# EAGLE design H3BR61_Hardware (EAGLE 9.6.2)

## Sheet 1 of 2
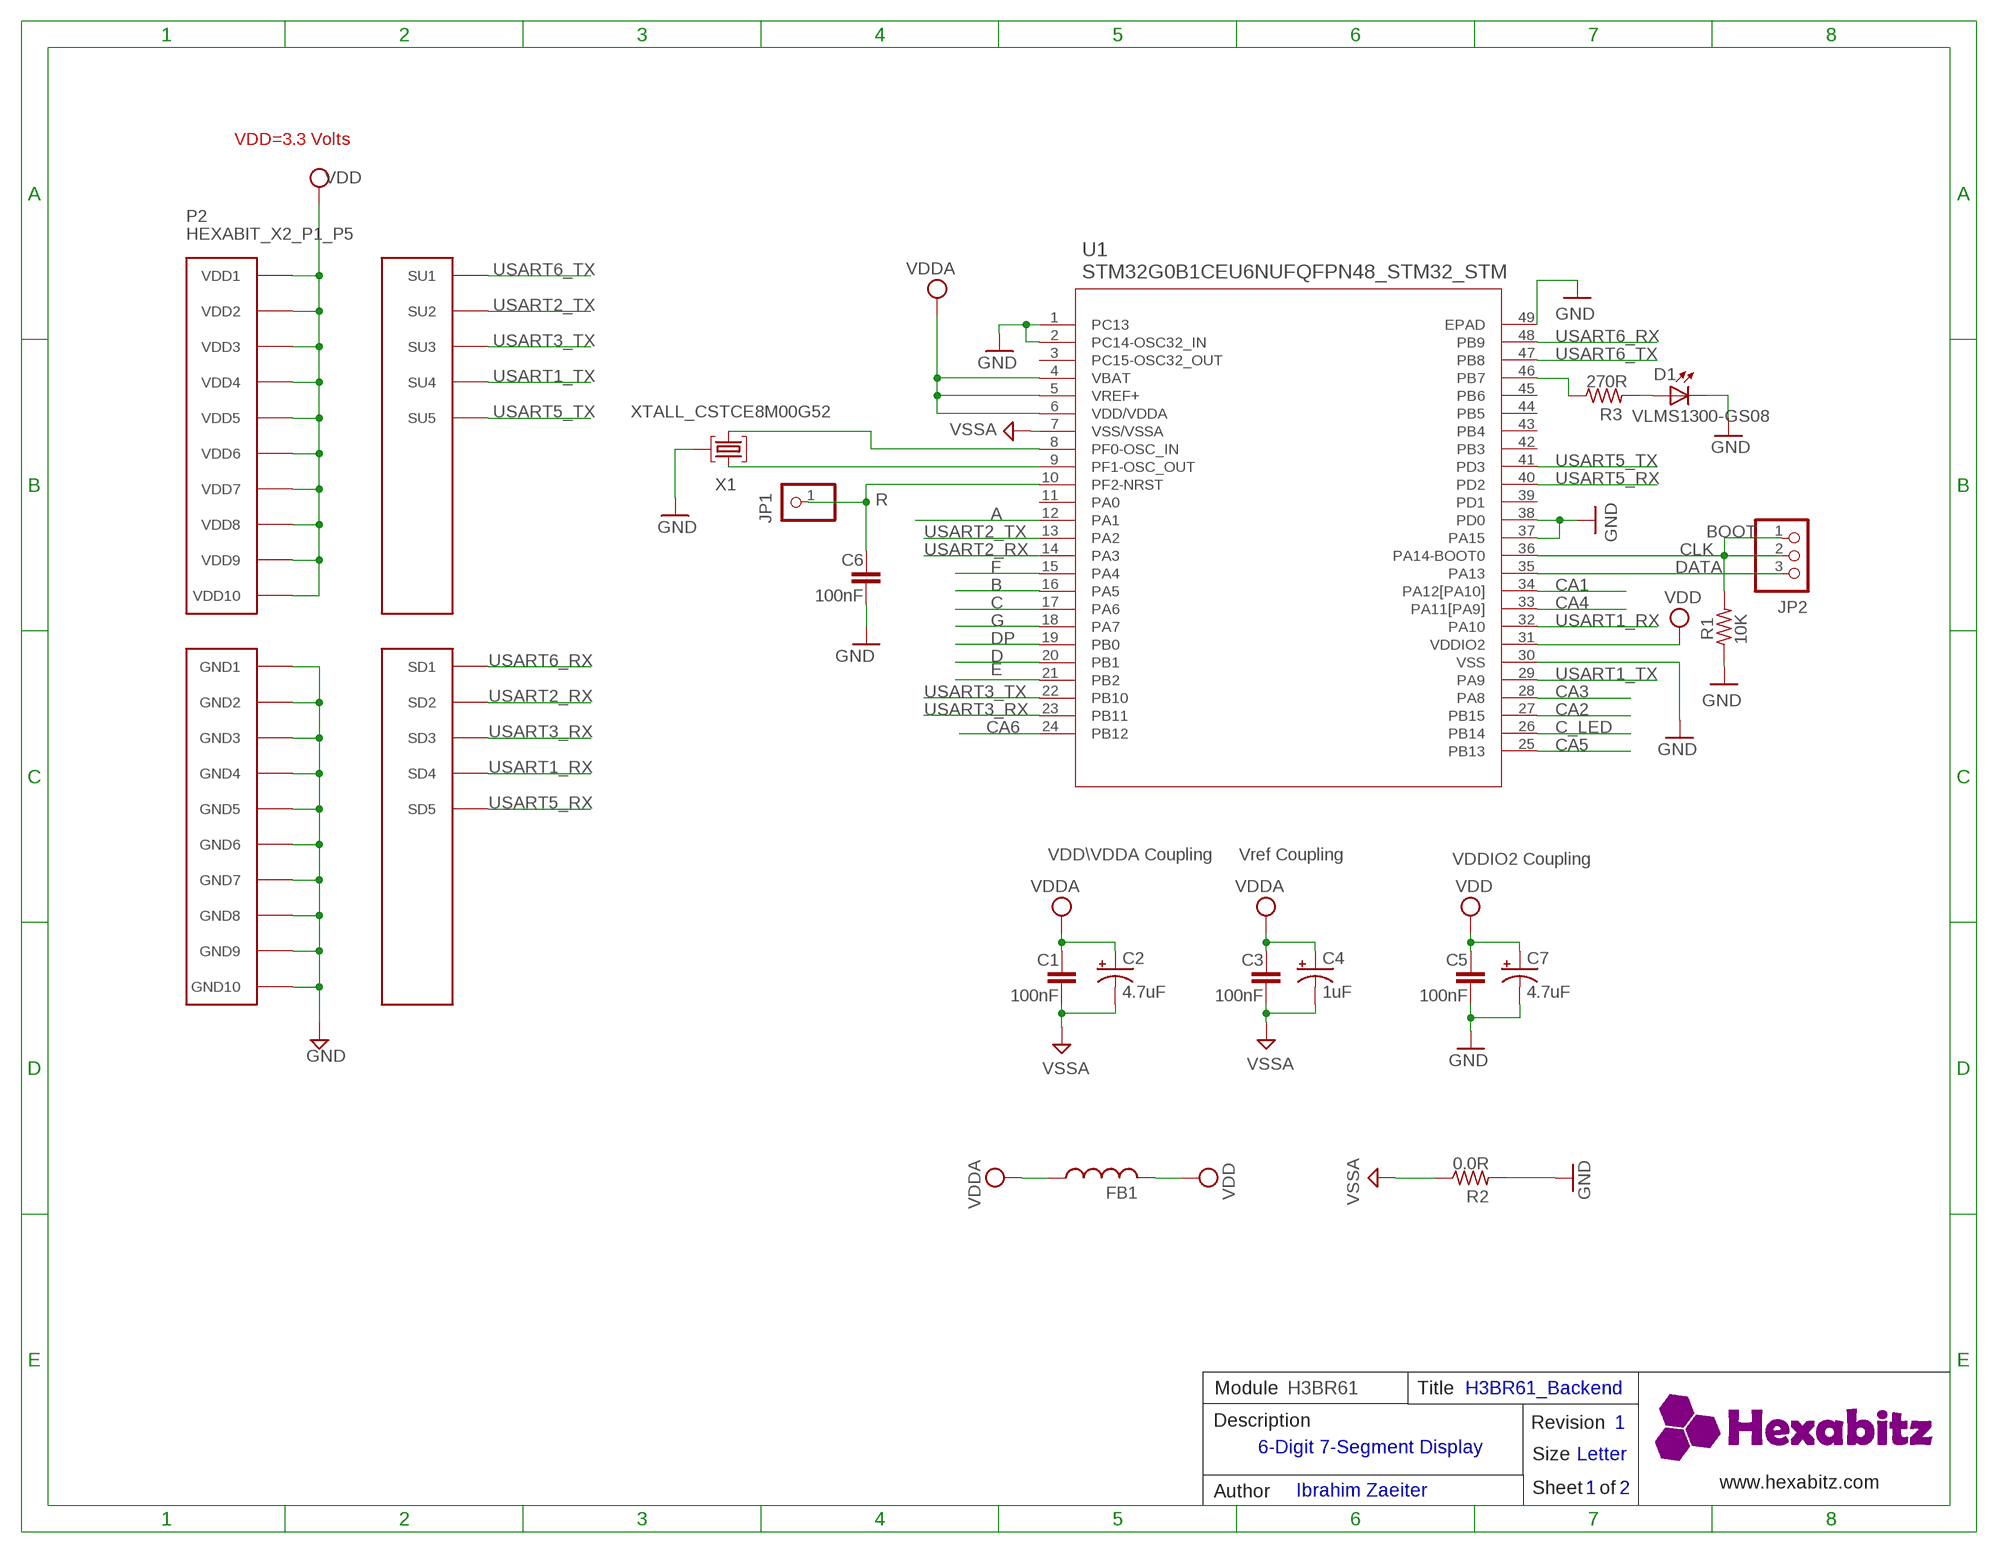
[diagram p0: schematic, sheet 1]

### Parts
C1  100nF  C-0603  [C-0603]
C2  4.7uF  C-0805-POL  [C-0805-POL]
C3  100nF  C-0603  [C-0603]
C4  1uF  C-0805-POL  [C-0805-POL]
C5  100nF  C-0603  [C-0603]
C6  100nF  C-0603  [C-0603]
C7  4.7uF  C-0805-POL  [C-0805-POL]
D1  VLMS1300-GS08  [VLMS1300-GS08]
FB1  FB-0603  [FB-0603]
JP1  R  PINHD-1X1  [1X01]
JP2  PINHD-1X3  [1X03]
P2  HEXABIT_X2_P1_P5  [HEXABIT_17.32_X2_P1_P5]
R1  10K  R-0603  [R-0603]
R2  0.0R  R-0603  [R-0603]
R3  270R  R-0603  [R-0603]
U1  STM32G0B1CEU6NUFQFPN48_STM32_STM  [UFQFPN48_STM32_STM]
X1  XTALL_CSTCE8M00G52  [XTALL_CSTCE8M00G52]

### Nets
A: U1.12(PA1) ; also sheet 2
B: U1.16(PA5) ; also sheet 2
C: U1.17(PA6) ; also sheet 2
C_LED: U1.26(PB14) ; also sheet 2
CA1: U1.34(PA12[PA10]) ; also sheet 2
CA2: U1.27(PB15) ; also sheet 2
CA3: U1.28(PA8) ; also sheet 2
CA4: U1.33(PA11[PA9]) ; also sheet 2
CA5: U1.25(PB13) ; also sheet 2
CA6: U1.24(PB12) ; also sheet 2
CLK: JP2.1 JP2.2 R1.2 U1.36(PA14-BOOT0)
D: U1.20(PB1) ; also sheet 2
DATA: JP2.3 U1.35(PA13)
DP: U1.19(PB0) ; also sheet 2
E: U1.21(PB2) ; also sheet 2
F: U1.15(PA4) ; also sheet 2
G: U1.18(PA7) ; also sheet 2
GND: C5.2 C6.2 C7.2(-) D1.C P2.PAD_PD11(GND1) P2.PAD_PD12(GND2) P2.PAD_PD13(GND3) P2.PAD_PD14(GND4) P2.PAD_PD15(GND5) P2.PAD_PD16(GND6) P2.PAD_PD17(GND7) P2.PAD_PD18(GND8) P2.PAD_PD19(GND9) P2.PAD_PD20(GND10) R1.1 R2.2 U1.1(PC13) U1.2(PC14-OSC32_IN) U1.30(VSS) U1.37(PA15) U1.38(PD0) U1.49(EPAD) X1.P$2 ; also sheet 2
N$1: D1.A R3.2
N$2: R3.1 U1.46(PB7)
N$5: U1.9(PF1-OSC_OUT) X1.P$1
N$6: U1.8(PF0-OSC_IN) X1.P$3
N$8: C6.1 JP1.1 U1.10(PF2-NRST)
USART1_RX: P2.PAD_PD4(SD4) U1.32(PA10)
USART1_TX: P2.PAD_PU4(SU4) U1.29(PA9)
USART2_RX: P2.PAD_PD2(SD2) U1.14(PA3)
USART2_TX: P2.PAD_PU2(SU2) U1.13(PA2)
USART3_RX: P2.PAD_PD3(SD3) U1.23(PB11)
USART3_TX: P2.PAD_PU3(SU3) U1.22(PB10)
USART5_RX: P2.PAD_PD5(SD5) U1.40(PD2)
USART5_TX: P2.PAD_PU5(SU5) U1.41(PD3)
USART6_RX: P2.PAD_PD1(SD1) U1.48(PB9)
USART6_TX: P2.PAD_PU1(SU1) U1.47(PB8)
VDD: C5.1 C7.1(+) FB1.2 P2.PAD_PU11(VDD1) P2.PAD_PU12(VDD2) P2.PAD_PU13(VDD3) P2.PAD_PU14(VDD4) P2.PAD_PU15(VDD5) P2.PAD_PU16(VDD6) P2.PAD_PU17(VDD7) P2.PAD_PU18(VDD8) P2.PAD_PU19(VDD9) P2.PAD_PU20(VDD10) U1.31(VDDIO2) ; also sheet 2
VDDA: C1.1 C2.1(+) C3.1 C4.1(+) FB1.1 U1.4(VBAT) U1.5(VREF+) U1.6(VDD/VDDA)
VSSA: C1.2 C2.2(-) C3.2 C4.2(-) R2.1 U1.7(VSS/VSSA)
Unconnected: U1.3(PC15-OSC32_OUT) U1.11(PA0) U1.39(PD1) U1.42(PB3) U1.43(PB4) U1.44(PB5) U1.45(PB6)

### Notes on the sheet
- VDD=3.3 Volts
- BOOT
- VDD\VDDA Coupling | Vref Coupling | VDDIO2 Coupling
- Module | H3BR61 | Title | H3BR61_Backend
- Description | Revision | 1
- 6-Digit 7-Segment Display
- Size | Letter
- www.hexabitz.com
- Author | Ibrahim Zaeiter | Sheet   of | 1 | 2
- C:/Users/Admin/Desktop/logodraft.bmp

## Sheet 2 of 2
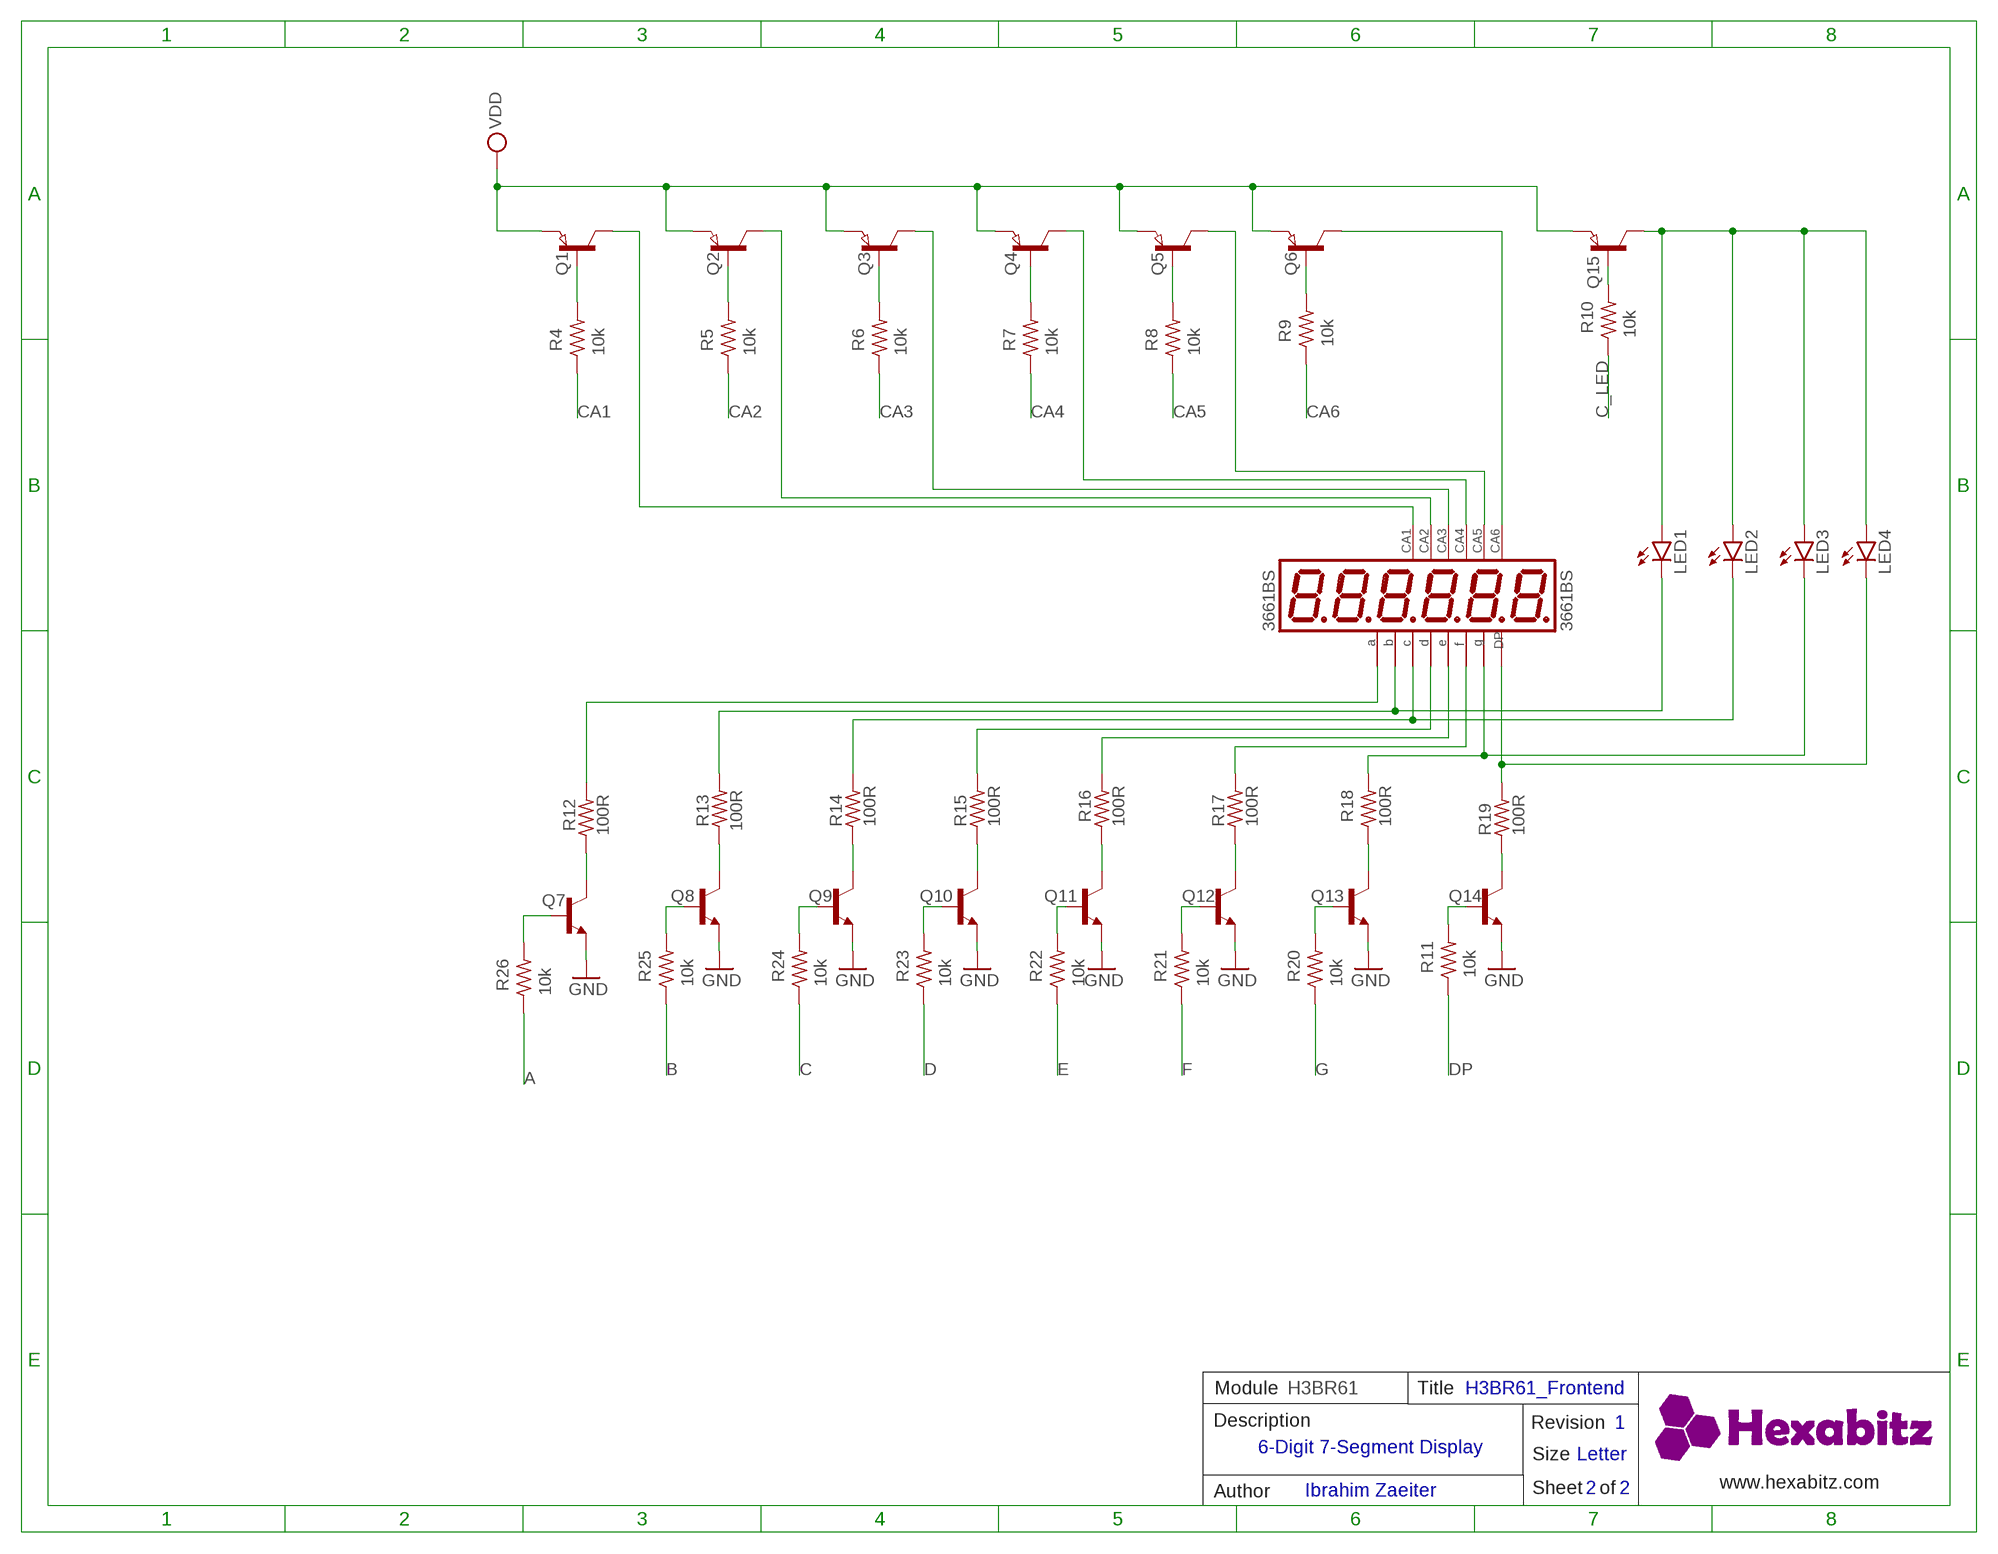
[diagram p1: schematic, sheet 2]

### Parts
3661BS  3661BS  [3661BS]
LED1  LED3MM  [LED3MM]
LED2  LED3MM  [LED3MM]
LED3  LED3MM  [LED3MM]
LED4  LED3MM  [LED3MM]
Q1  SEMICON-SMD-IPC_PNP-TRANSISTOR_SOT23  [SEMICON-SMD-IPC_SOT23]
Q2  SEMICON-SMD-IPC_PNP-TRANSISTOR_SOT23  [SEMICON-SMD-IPC_SOT23]
Q3  SEMICON-SMD-IPC_PNP-TRANSISTOR_SOT23  [SEMICON-SMD-IPC_SOT23]
Q4  SEMICON-SMD-IPC_PNP-TRANSISTOR_SOT23  [SEMICON-SMD-IPC_SOT23]
Q5  SEMICON-SMD-IPC_PNP-TRANSISTOR_SOT23  [SEMICON-SMD-IPC_SOT23]
Q6  SEMICON-SMD-IPC_PNP-TRANSISTOR_SOT23  [SEMICON-SMD-IPC_SOT23]
Q7  MMBT3904LT1  [MMBT3904LT1]
Q8  MMBT3904LT1  [MMBT3904LT1]
Q9  MMBT3904LT1  [MMBT3904LT1]
Q10  MMBT3904LT1  [MMBT3904LT1]
Q11  MMBT3904LT1  [MMBT3904LT1]
Q12  MMBT3904LT1  [MMBT3904LT1]
Q13  MMBT3904LT1  [MMBT3904LT1]
Q14  MMBT3904LT1  [MMBT3904LT1]
Q15  SEMICON-SMD-IPC_PNP-TRANSISTOR_SOT23  [SEMICON-SMD-IPC_SOT23]
R4  10k  R-0603  [R-0603]
R5  10k  R-0603  [R-0603]
R6  10k  R-0603  [R-0603]
R7  10k  R-0603  [R-0603]
R8  10k  R-0603  [R-0603]
R9  10k  R-0603  [R-0603]
R10  10k  R-0603  [R-0603]
R11  10k  R-0603  [R-0603]
R12  100R  R-0603  [R-0603]
R13  100R  R-0603  [R-0603]
R14  100R  R-0603  [R-0603]
R15  100R  R-0603  [R-0603]
R16  100R  R-0603  [R-0603]
R17  100R  R-0603  [R-0603]
R18  100R  R-0603  [R-0603]
R19  100R  R-0603  [R-0603]
R20  10k  R-0603  [R-0603]
R21  10k  R-0603  [R-0603]
R22  10k  R-0603  [R-0603]
R23  10k  R-0603  [R-0603]
R24  10k  R-0603  [R-0603]
R25  10k  R-0603  [R-0603]
R26  10k  R-0603  [R-0603]

### Nets
A: R26.1 ; also sheet 1
B: R25.1 ; also sheet 1
C: R24.1 ; also sheet 1
C_LED: R10.1 ; also sheet 1
CA1: R4.1 ; also sheet 1
CA2: R5.1 ; also sheet 1
CA3: R6.1 ; also sheet 1
CA4: R7.1 ; also sheet 1
CA5: R8.1 ; also sheet 1
CA6: R9.1 ; also sheet 1
D: R23.1 ; also sheet 1
DP: R11.1 ; also sheet 1
E: R22.1 ; also sheet 1
F: R21.1 ; also sheet 1
G: R20.1 ; also sheet 1
GND: Q7.2(E) Q8.2(E) Q9.2(E) Q10.2(E) Q11.2(E) Q12.2(E) Q13.2(E) Q14.2(E) ; also sheet 1
N$9: Q7.1(B) R26.2
N$10: Q8.1(B) R25.2
N$11: Q9.1(B) R24.2
N$12: Q10.1(B) R23.2
N$13: Q11.1(B) R22.2
N$14: Q12.1(B) R21.2
N$15: Q13.1(B) R20.2
N$16: Q14.1(B) R11.2
N$17: Q7.3(C) R12.1
N$18: Q8.3(C) R13.1
N$19: Q9.3(C) R14.1
N$20: Q10.3(C) R15.1
N$21: Q11.3(C) R16.1
N$22: Q12.3(C) R17.1
N$23: Q13.3(C) R18.1
N$24: Q14.3(C) R19.1
N$25: Q1.1(B) R4.2
N$26: Q2.1(B) R5.2
N$27: Q3.1(B) R6.2
N$28: Q4.1(B) R7.2
N$29: Q5.1(B) R8.2
N$30: Q6.1(B) R9.2
N$31: 3661BS.3(DP) LED4.K(C) R19.2
N$32: 3661BS.5(G) LED3.K(C) R18.2
N$33: 3661BS.12(F) R17.2
N$34: 3661BS.1(E) R16.2
N$35: 3661BS.2(D) R15.2
N$36: 3661BS.4(C) LED2.K(C) R14.2
N$37: 3661BS.9(B) LED1.K(C) R13.2
N$38: 3661BS.13(A) R12.2
N$39: 3661BS.7(CA) Q6.3(C)
N$40: 3661BS.6(CA) Q5.3(C)
N$41: 3661BS.8(CA) Q4.3(C)
N$42: 3661BS.10(CA) Q3.3(C)
N$43: 3661BS.11(CA) Q2.3(C)
N$44: 3661BS.14(CA) Q1.3(C)
N$45: Q15.1(B) R10.2
N$46: LED1.A LED2.A LED3.A LED4.A Q15.3(C)
VDD: Q1.2(E) Q2.2(E) Q3.2(E) Q4.2(E) Q5.2(E) Q6.2(E) Q15.2(E) ; also sheet 1

### Notes on the sheet
- Module | H3BR61 | Title | H3BR61_Frontend
- Description | Revision | 1
- 6-Digit 7-Segment Display
- Size | Letter
- www.hexabitz.com
- Author | Ibrahim Zaeiter | Sheet   of | 2 | 2
- C:/Users/Admin/Desktop/logodraft.bmp

## Library data of the parts
3661BS = HEXABITZ_OTHER_PARTS:3661BS: 0.36inch 6digits RED 8 segment led display 3661BS
C1 C3 C5 C6 = HEXABITZ_RCLS:C-0603: CAP CER 10% X7R 0603
C2 C4 C7 = HEXABITZ_RCLS:C-0805-POL: Cap Tant Solid SMD 2012
D1 = Hexabitz:VLMS1300-GS08: Red 0603 130° Clear 54 mcd 2 V Surface Mount ChipLED ; Octopart Url : http://octopart.com/vlms1300-gs08-vishay-21709201; MFN: Vishay; MPN: VLMS1300-GS08; OCTOPART_URL: https://octopart.com/vlms1300-gs08-vishay-21709201?r=sp&s=_gcP4_q8T1SC6PJQPTQ9yA
FB1 = HEXABITZ_RCLS:FB-0603: Ferrite Beads Multi-Layer 0603
JP1 = HEXABITZ_USER_INTERFACE_PARTS:PINHD-1X1: PIN HEADER; MFN: TE Connectivity; MPN: 87227-1; OCTOPART_URL: https://octopart.com/87227-1-te+connectivity-39512052?r=sp
JP2 = pinhead:PINHD-1X3: PIN HEADER
LED1-LED4 = led:LED: LED OSRAM: - CHIPLED LG R971, LG N971, LY N971, LG Q971, LY Q971, LO R971, LY R971 LH N974, LH R974 LS Q976, LO Q976, LY Q976 LO Q996 - Hyper CHIPLED LW Q18S LB Q993, LB Q99A, LB R99A - SideLED LS A670, LO A670, LY A670, LG A670, LP A670 LB A673, LV A673, LT A673, LW A673 LH A674 LY A675 LS A676, LA A676, LO A676, LY A676, LW A676 LS A679, LY A679, LG A679 - Hyper Micro SIDELED® LS Y876, LA Y876, LO Y876, LY Y876 LT Y87S - SmartLED LW L88C, LW L88S LB L89C, LB L89S, LG L890 LS L89K, LO L89K, LY L89K LS L896, LA L896, LO L896, LY L896 - TOPLED LS T670, LO T670, LY T670, LG T670, LP T670 LSG T670, LSP T670, LSY T670, LOP T670, LYG T670 LG T671, LOG T671, LSG T671 LB T673, LV T673, LT T673, LW T673 LH T674 LS T676, LA T676, LO T676, LY T676, LB T676, LH T676, LSB T676, LW T676 LB T67C, LV T67C, LT T67C, LS T67K, LO T67K, LY T67K, LW E67C LS E67B, LA E67B, LO E67B, LY E67B, LB E67C, LV E67C, LT E67C LW T67C LS T679, LY T679, LG T679 LS T770, LO T770, LY T770, LG T770, LP T770 LB T773, LV T773, LT T773, LW T773 LH T774 LS E675, LA E675, LY E675, LS T675 LS T776, LA T776, LO T776, LY T776, LB T776 LHGB T686 LT T68C, LB T68C - Hyper Mini TOPLED® LB M676 - Mini TOPLED Santana® LG M470 LS M47K, LO M47K, LY M47K Source: http://www.osram.convergy.de LUXEON: - LUMILED® LXK2-PW12-R00, LXK2-PW12-S00, LXK2-PW14-U00, LXK2-PW14-V00 LXK2-PM12-R00, LXK2-PM12-S00, LXK2-PM14-U00 LXK2-PE12-Q00, LXK2-PE12-R00, LXK2-PE12-S00, LXK2-PE14-T00, LXK2-PE14-U00 LXK2-PB12-K00, LXK2-PB12-L00, LXK2-PB12-M00, LXK2-PB14-N00, LXK2-PB14-P00, LXK2-PB14-Q00 LXK2-PR12-L00, LXK2-PR12-M00, LXK2-PR14-Q00, LXK2-PR14-R00 LXK2-PD12-Q00, LXK2-PD12-R00, LXK2-PD12-S00 LXK2-PH12-R00, LXK2-PH12-S00 LXK2-PL12-P00, LXK2-PL12-Q00, LXK2-PL12-R00 Source: www.luxeon.com KINGBRIGHT: KA-3528ASYC Source: www.kingbright.com
P2 = hexabitz_connectors:HEXABIT_X2_P1_P5
Q1-Q6 Q15 = HEXABITZ_RCLS:SEMICON-SMD-IPC_PNP-TRANSISTOR_: PNP TRANSISTOR
Q7-Q14 = HEXABITZ_RCLS:MMBT3904LT1: TRANS NPN 40V 0.2A SOT23; MOUNTING_STYLE: Surface Mount; NUM_OF_PINS: 3; PACKAGE: SOT-23-3; PACKAGING: Reel; PRODUCT_CATEGORY: Transistors Bipolar-BJT; SERIES: MMBT3904L
R1-R26 = HEXABITZ_RCLS:R-0603: Thick Film Resistors - SMD 0603
U1 = HEXABITZ_ICs:STM32G0B1CEU6N; COPYRIGHT: Copyright (C) 2022 Ultra Librarian. All rights reserved.; MFN: STMicroelectronics; MPN: STM32G0B1CEU6N; OCTOPART_URL: https://app.ultralibrarian.com/details/c038d58b-752a-11eb-9033-0a34d6323d74/STMicroelectronics/STM32G0B1CEU6N?uid=116364672
X1 = Hexabitz:XTALL_CSTCE8M00G52: MURATA CSTCE8M00G52-R0 RESONATOR, SMD, 8MHZ ; Octopart Url : https://octopart.com/cstce8m00g52-r0-murata-7145559; MFN: Murata; MPN: CSTCE8M00G52Z-R0; OCTOPART_URL: https://octopart.com/cstce8m00g52z-r0-murata-17755941?r=sp&s=JDnNJnrHQhyS8Zk4ofFWXw

## Board
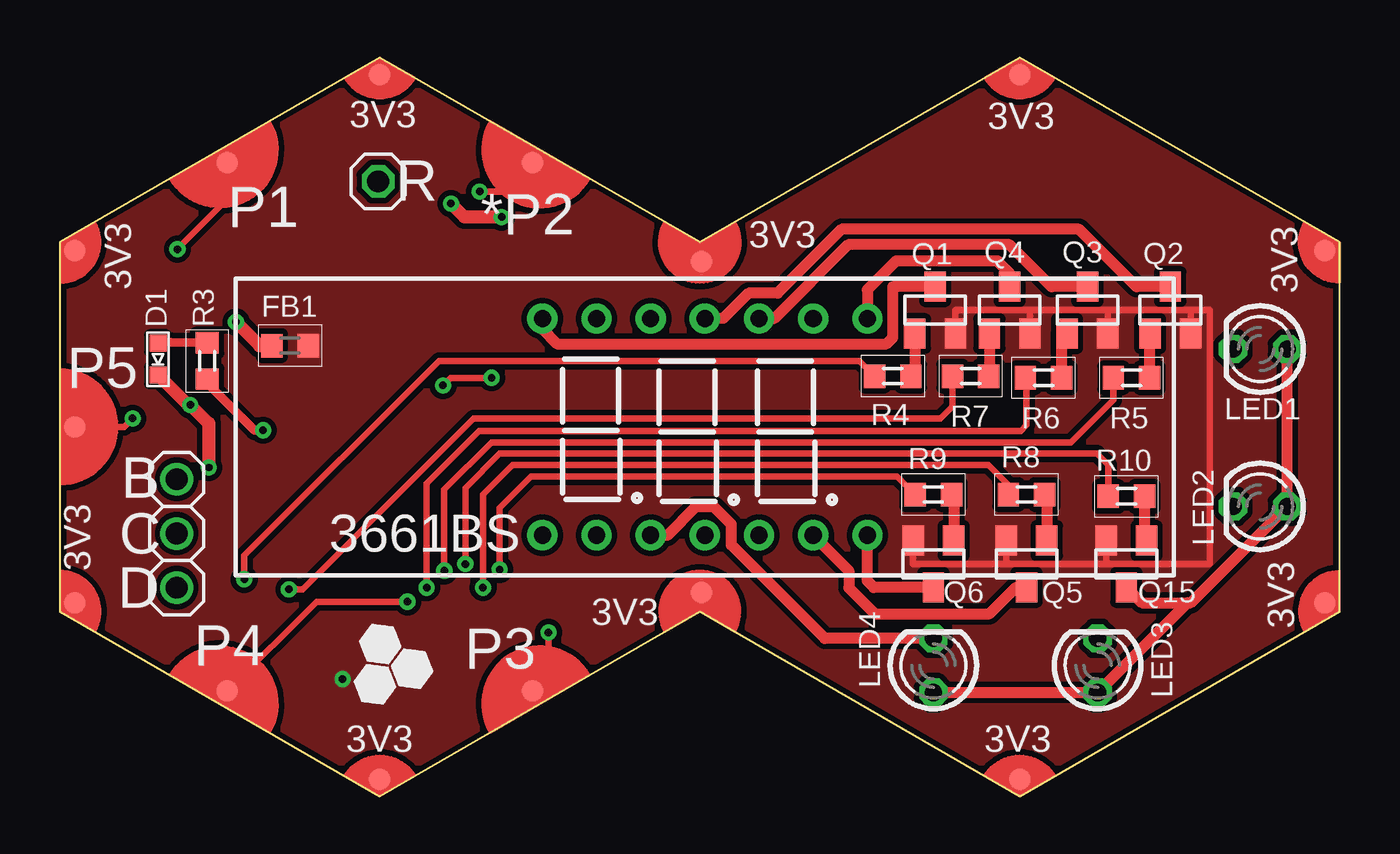
[diagram p2: board, top side]
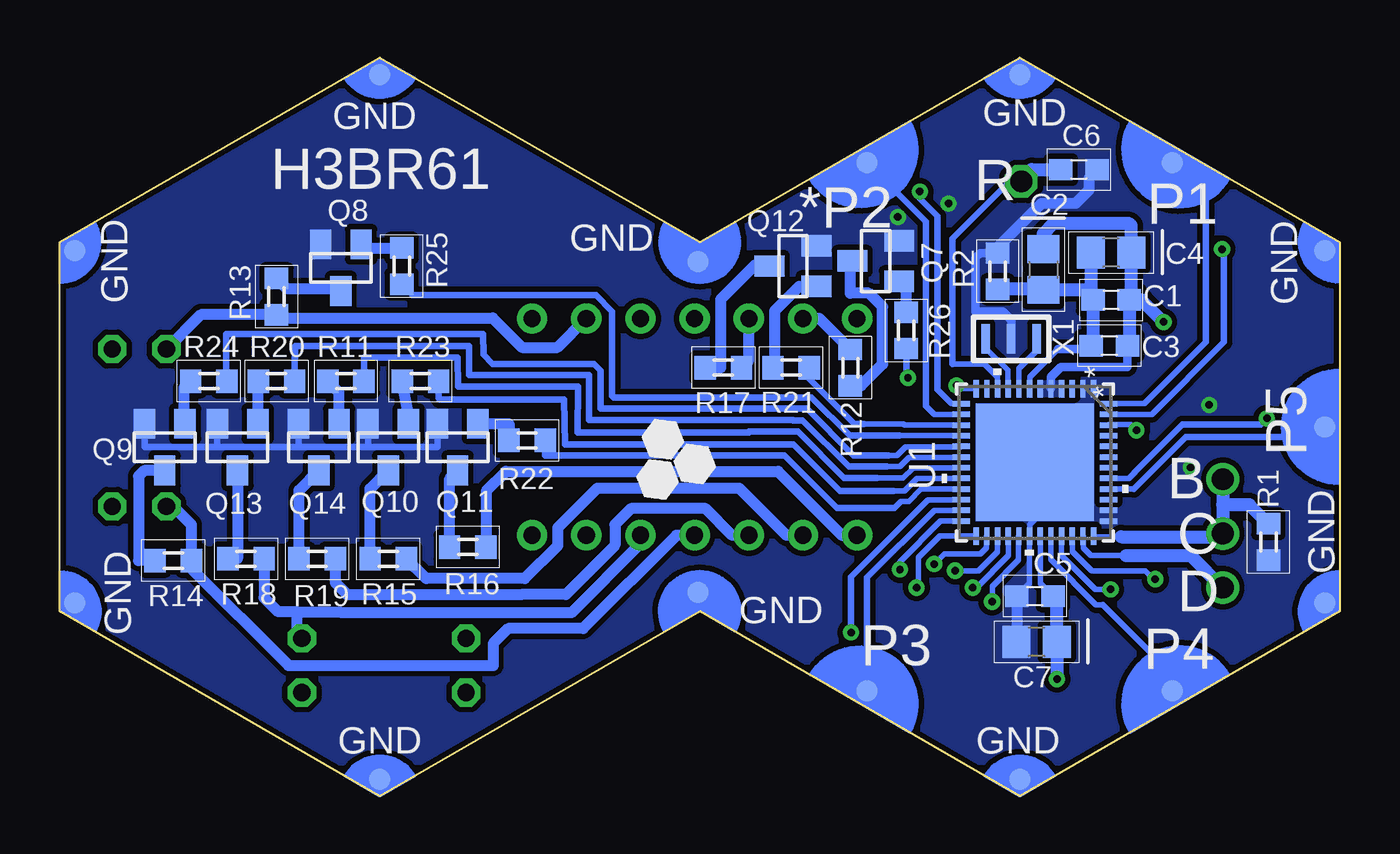
[diagram p3: board, bottom side, seen from below]

Size 60 x 34.64 mm. Coordinates in mm from the lower left corner, seen from the top.
Copper layers (1*16): Top 0.035mm / dielectric 1.5mm / Bottom 0.035mm
Design rules "default *": minimum track width 6mil, minimum drill 0.35mm, track to track 9mil, track to pad 9mil, pad to pad 9mil, via to via 9mil, smd to smd 9mil, copper to edge 10mil, drill to drill 6mil, minimum pad ring 10mil, minimum via ring 8mil, stop-mask expansion 4mil, vias tented up to drill 24mil, thermal gap 10mil

### Footprints (pad centres in the part's own frame; a part is rotated, then mirrored left to right if it is on the bottom)
3661BS = drill 0.8 pad 1.422: 1 -7.62,-5.08; 2 -5.08,-5.08; 3 -2.54,-5.08; 4 0,-5.08; 5 2.54,-5.08; 6 5.08,-5.08; 7 7.62,-5.08; 8 7.62,5.08; 9 5.08,5.08; 10 2.54,5.08; 11 0,5.08; 12 -2.54,5.08; 13 -5.08,5.08; 14 -7.62,5.08
C-0603 = smd 1.1 x 1: 1 -0.85,0; 2 0.85,0
C-0805-POL = smd 1.3 x 1.5: 1 -0.95,0; 2 0.95,0
VLMS1300-GS08 = smd 0.8 x 0.8: A 0,0.75; C 0,-0.75
FB-0603 = smd 1 x 1.1: 1 -0.85,0; 2 0.85,0
1X01 = drill 1.016 octagon: 1 0,0
1X03 = drill 1.016: 1 -2.54,0; 2 0,0; 3 2.54,0
LED3MM = drill 0.813 octagon: A -1.27,0; K 1.27,0
HEXABIT_17.32_X2_P1_P5 = smd 1 x 1 bottom: PAD_PD1 12.39,22.39; PAD_PD2 12.39,8.09; PAD_PD3 -12.39,8.09; PAD_PD4 -12.39,22.39; PAD_PD5 0,29.55; PAD_PD12 16.52,15.24; PAD_PD13 7.752,0.168; PAD_PD14 16.52,-14.76; PAD_PD15 8.26,-29.07; PAD_PD16 -8.26,-29.07; PAD_PD17 -16.52,-14.76; PAD_PD18 -7.752,0.168; PAD_PD19 -16.52,15.24 | smd 1 x 1 rotated 60 bottom: PAD_PD11 8.26,29.547 | smd 1 x 1 rotated 120 bottom: PAD_PD20 -8.26,29.547 | smd 1 x 1: PAD_PU1 12.39,22.39; PAD_PU2 12.39,8.09; PAD_PU3 -12.39,8.09; PAD_PU4 -12.39,22.39; PAD_PU5 0,29.55; PAD_PU12 16.52,15.24; PAD_PU13 7.752,0.168; PAD_PU14 16.52,-14.76; PAD_PU15 8.26,-29.07; PAD_PU16 -8.26,-29.07; PAD_PU17 -16.52,-14.76; PAD_PU18 -7.752,0.168; PAD_PU19 -16.52,15.24 | smd 1 x 1 rotated 60: PAD_PU11 8.26,29.547 | smd 1 x 1 rotated 120: PAD_PU20 -8.26,29.547
SEMICON-SMD-IPC_SOT23 = smd 1 x 1.4: 1 -0.95,-1.1; 2 0.95,-1.1; 3 0,1.1
MMBT3904LT1 = smd 1 x 1.4: 1 -0.95,-1.1; 2 0.95,-1.1; 3 0,1.1
R-0603 = smd 1 x 1.1: 1 -0.85,0; 2 0.85,0
UFQFPN48_STM32_STM = smd 0.813 x 0.254: 1 -3.454,2.751; 2 -3.454,2.251; 3 -3.454,1.75; 4 -3.454,1.25; 5 -3.454,0.75; 6 -3.454,0.25; 7 -3.454,-0.25; 8 -3.454,-0.75; 9 -3.454,-1.25; 10 -3.454,-1.75; 11 -3.454,-2.251; 12 -3.454,-2.751; 25 3.454,-2.751; 26 3.454,-2.251; 27 3.454,-1.75; 28 3.454,-1.25; 29 3.454,-0.75; 30 3.454,-0.25; 31 3.454,0.25; 32 3.454,0.75; 33 3.454,1.25; 34 3.454,1.75; 35 3.454,2.251; 36 3.454,2.751 | smd 0.254 x 0.813: 13 -2.751,-3.454; 14 -2.251,-3.454; 15 -1.75,-3.454; 16 -1.25,-3.454; 17 -0.75,-3.454; 18 -0.25,-3.454; 19 0.25,-3.454; 20 0.75,-3.454; 21 1.25,-3.454; 22 1.75,-3.454; 23 2.251,-3.454; 24 2.751,-3.454; 37 2.751,3.454; 38 2.251,3.454; 39 1.75,3.454; 40 1.25,3.454; 41 0.75,3.454; 42 0.25,3.454; 43 -0.25,3.454; 44 -0.75,3.454; 45 -1.25,3.454; 46 -1.75,3.454; 47 -2.251,3.454; 48 -2.751,3.454 | smd 5.512 x 5.512: 49 0,0
XTALL_CSTCE8M00G52 = smd 1.4 x 0.4: P$1 0,1.2; P$2 0,0; P$3 0,-1.2

### Placement (x,y rotation side)
3661BS  30.24,17.32 0 top
C1  10.71,23.27 180 bottom
C2  13.89,24.7 270 bottom
C3  10.79,21.13 180 bottom
C4  10.71,25.5 180 bottom
C5  14.29,9.38 180 bottom
C6  12.22,29.38 0 bottom
C7  14.21,7.24 180 bottom
D1  4.6,20.5 0 top
FB1  10.79,21.13 0 top
JP1  14.92,28.83 0 top
JP2  5.47,12.32 270 top
LED1  56.27,20.97 180 top
LED2  56.27,13.59 180 top
LED3  48.66,6.13 90 top
LED4  40.96,6.13 90 top
P2  30.24,17.32 90 top
Q1  41.03,22.8 0 top
Q2  52.07,22.8 0 top
Q3  48.18,22.8 0 top
Q4  44.53,22.8 0 top
Q5  45.32,10.89 180 top
Q6  40.96,10.89 180 top
Q7  21.75,25.1 90 bottom
Q8  46.83,24.78 180 bottom
Q9  55.08,16.37 180 bottom
Q10  44.61,16.37 180 bottom
Q11  41.35,16.37 180 bottom
Q12  25.64,24.86 90 bottom
Q13  51.67,16.37 180 bottom
Q14  47.86,16.37 180 bottom
Q15  50,10.89 180 top
R1  3.33,11.92 90 bottom
R2  16.03,24.62 90 bottom
R3  6.9,20.42 90 top
R4  39.05,19.7 0 top
R5  50.24,19.62 0 top
R6  46.11,19.62 0 top
R7  42.7,19.7 0 top
R8  45.32,14.14 0 top
R9  40.96,14.14 0 top
R10  50,14.07 0 top
R11  46.59,19.46 180 bottom
R12  22.94,20.1 90 bottom
R13  49.85,23.43 270 bottom
R14  54.69,11.05 0 bottom
R15  44.61,11.13 0 bottom
R16  40.88,11.68 0 bottom
R17  28.89,20.1 0 bottom
R18  51.27,11.13 0 bottom
R19  47.94,11.13 0 bottom
R20  49.85,19.46 180 bottom
R21  25.72,20.1 180 bottom
R22  38.1,16.68 180 bottom
R23  43.1,19.46 180 bottom
R24  53.02,19.46 180 bottom
R25  43.97,24.86 90 bottom
R26  20.32,21.84 90 bottom
U1  14.29,15.65 270 bottom
X1  15.4,21.45 90 bottom

### Tracks (layer width: path | path; a pad name or v marks a point on that pad's centre or on a via)
A  (via drill 0.35)
  Top 0.305: v20.24,19.62 18.32,19.62 v17.96,19.26
  Bottom 0.254: U1.12 17.8,19.11 v17.96,19.26
  Bottom 0.305: R26.1 20.32,19.7 v20.24,19.62
B
  Bottom 0.254: 20.64,16.92 17.76,16.92 U1.16
  Bottom 0.305: 20.64,16.92 22.97,16.92 24.75,18.7 34.05,18.7 34.11,18.77 34.11,22.74 34.87,23.49 43.45,23.49 R25.1
C
  Bottom 0.254: 21.15,15.99 20.76,15.99 20.37,16.39 17.76,16.39 U1.17
  Bottom 0.305: R24.1 52.21,19.5 52.21,21.66 40.15,21.66 40.14,20.71 39.71,20.28 34.96,20.28 34.65,19.96 34.65,18.17 24.97,18.17 22.79,15.99 21.15,15.99
C_LED  (via drill 0.35)
  Top 0.305: R10.1 49.15,15.53 48.62,16.06 20.61,16.06 19.01,14.46 v19.01,10.89
  Bottom 0.254: U1.26 16.55,12.18 16.55,11.64 16.83,11.37 18.53,11.37 v19.01,10.89
CA1  (via drill 0.35)
  Top 0.305: R4.1 37.49,20.42 17.77,20.42 8.64,11.29 v8.64,10.18
  Bottom 0.254: U1.34 12.54,11.48 11.62,10.57 9.11,10.57 8.72,10.18 v8.64,10.18
CA2  (via drill 0.35)
  Top 0.305: R5.1 49.39,18.59 47.4,16.6 20.23,16.6 18.02,14.39 v18.02,10.57
  Bottom 0.254: U1.27 16.05,12.18 16.05,11.46 16.94,10.57 v18.02,10.57
CA3  (via drill 0.35)
  Top 0.305: R6.1 45.32,19.57 45.32,17.4 45.05,17.13 19.65,17.13 17.2,14.68 v17.2,9.78
  Bottom 0.254: U1.28 15.54,11.28 17.04,9.78 v17.2,9.78
CA4  (via drill 0.35)
  Top 0.305: R7.1 41.85,18.27 41.3,17.72 19.39,17.72 11.37,9.7 v10.74,9.7
  Bottom 0.254: v10.74,9.7 11.45,9.7 13.04,11.28 U1.33
CA5  (via drill 0.35)
  Top 0.305: R8.1 44.47,14.6 43.54,15.53 21.23,15.53 19.84,14.14 v19.84,9.78
  Bottom 0.254: v19.84,9.78 19.74,9.87 19.74,11.2 18.74,12.2 U1.25
CA6  (via drill 0.35)
  Top 0.305: v20.61,10.63 20.61,13.53 22.09,15 39.25,15 R9.1
  Bottom 0.254: v20.61,10.63 v20.62,10.64 20.62,11 18.72,12.9 U1.24
CLK
  Bottom 0.254: U1.36 11.5,12.16 10.24,12.16
  Bottom 0.61: 10.24,12.16 5.63,12.16 JP2.2 5.47,13.67 | JP2.1 5.47,13.67 | R1.2 4.23,13.67 5.47,13.67
D
  Bottom 0.254: U1.20 17.76,14.92 17.78,14.89 19.81,14.89 20.4,14.31 20.91,14.31
  Bottom 0.305: R23.1 42.25,18.67 42.19,18.61 36.36,18.61 36.32,16.5 25.61,16.5 23.42,14.31 20.91,14.31
DATA
  Bottom 0.254: U1.35 12.02,12.18 12.02,11.64 11.66,11.29 10,11.29
  Bottom 0.61: 10,11.29 6.98,11.29 JP2.3
DP
  Bottom 0.254: 21.7,14.92 20.47,14.92 19.98,15.4 U1.19
  Bottom 0.305: R11.1 45.74,20.57 41.35,20.57 41.34,19.21 35.71,19.21 35.73,17.05 27.7,17.05 27.7,17.09 25.4,17.09 23.23,14.92 21.7,14.92
E
  Bottom 0.254: U1.21 19.62,14.4 20.2,13.83 20.56,13.83 20.87,13.51
  Bottom 0.305: R22.1 37.25,15.97 26.03,15.97 23.57,13.51 20.87,13.51
F
  Bottom 0.254: U1.15 20.4,17.4 20.45,17.45 22.3,17.45
  Bottom 0.305: R21.1 24.87,19.57 22.75,17.45 22.3,17.45
G
  Bottom 0.254: 21.23,15.45 20.62,15.45 20.18,15.89 17.76,15.89 U1.18
  Bottom 0.305: R20.1 49,20.57 48.97,20.57 48.97,21.11 40.8,21.11 40.8,19.74 35.18,19.74 35.18,17.64 25.64,17.64 25.62,17.62 25.18,17.62 23.01,15.45 21.23,15.45
GND  (via drill 0.35)
  Top 0.406: v6.11,18.35 6.03,18.32
  Top 0.61: D1.C 6.03,18.32 | v20.71,27.16 18.97,27.16 v18.33,27.8 | v6.11,18.35 6.98,17.48 v6.98,15.41
  Bottom 0.254: C5.2 14.54,9.98 U1.30 14.52,12.22 14.52,12.75 14.29,12.98 U1.49
  Bottom 0.305: Q9.2 56.03,16.39 52.54,16.39 | 52.54,16.39 48.81,16.39 | 48.81,16.39 45.8,16.39 | 45.8,16.39 45.56,16.39 Q10.2 | Q11.2 42.3,16.37 45.8,16.37 45.8,16.39 | Q14.2 48.81,16.39 | Q13.2 52.62,16.46 52.54,16.39
  Bottom 0.406: X1.P$2 15.4,22.32 15.79,22.72 17.06,22.72 17.06,25.26 16.85,25.47 16.3,25.47 | 16.11,25.47 R2.2
  Bottom 0.508: C5.2 15.14,7.26 C7.2 | 16.3,25.47 13.98,27.8 12.38,27.8 11.75,28.43 11.75,29.01 C6.2
  pour Bottom (isolate 0.254, no thermals): 29.84,26.13 15,34.62 0.08,26.05 0,8.75 14.92,0.02 29.92,8.59 44.92,0.02 60.01,8.59 60.01,25.89 45.08,34.62 29.92,25.97 29.68,26.21
N$1
  Top 0.406: R3.2 5.19,21.27 5.18,21.3 5.19,21.29 D1.A
N$2  (via drill 0.35)
  Top 0.406: R3.1 6.9,19.38 9.13,17.16 v9.52,17.16
  Bottom 0.254: v9.52,17.16 9.78,17.42 10.81,17.42 U1.46
N$5
  Bottom 0.254: U1.9 15.55,19.12 15.55,19.98 16.6,21.02 X1.P$1
N$6
  Bottom 0.254: X1.P$3 14.2,20.89 15.04,20.05 U1.8
N$8
  Bottom 0.254: U1.10 16.05,19.12 16.05,19.66 16.65,20.26 18.15,20.26
  Bottom 0.305: 18.15,20.26 18.15,26.15 15.48,28.83 15,28.83 JP1.1
  Bottom 0.508: 15,28.83 14.44,29.38
  Bottom 0.61: 14.44,29.38 C6.1
N$9
  Bottom 0.508: R26.2 20.32,23.82 Q7.1
N$10
  Bottom 0.508: Q8.1 45.71,25.71 R25.2
N$11
  Bottom 0.508: Q9.1 54.19,17.52 54.19,19.15 R24.2
N$12
  Bottom 0.508: Q10.1 43.66,17.88 R23.2
N$13
  Bottom 0.508: Q11.1 38.95,17.47 R22.2
N$14
  Bottom 0.508: R21.2 26.49,20.18 26.49,22.76 25.34,23.91 Q12.1
N$15
  Bottom 0.508: Q13.1 50.7,17.49 R20.2
N$16
  Bottom 0.508: Q14.1 46.91,18.93 R11.2
N$17
  Bottom 0.508: R12.1 22.44,19.25 21.43,20.26 21.43,22.95 22.07,23.59 22.94,23.59 22.94,25.01 Q7.3
N$18
  Bottom 0.508: R13.1 49.37,23.81 46.95,23.81 Q8.3
N$19
  Bottom 0.508: Q9.3 56.05,15.27 56.31,15.02 56.31,11.05 R14.1
N$20
  Bottom 0.508: R15.1 45.46,14.42 Q10.3
N$21
  Bottom 0.508: R16.1 41.73,14.89 Q11.3
N$22
  Bottom 0.508: Q12.3 26.68,24.91 26.95,24.91 27.41,24.91 29.02,23.3 29.02,20.1 R17.1
N$23
  Bottom 0.508: R18.1 51.67,11.14 Q13.3
N$24
  Bottom 0.508: R19.1 48.79,14.34 Q14.3
N$25
  Top 0.508: Q1.1 40.09,19.89 R4.2
N$26
  Top 0.508: R5.2 51.09,21.67 Q2.1
N$27
  Top 0.508: Q3.1 46.97,21.7 R6.2
N$28
  Top 0.508: Q4.1 43.58,19.73 R7.2
N$29
  Top 0.508: R8.2 46.27,14.05 Q5.1
N$30
  Top 0.508: R9.2 41.91,14.05 Q6.1
N$31
  Top 0.508: 3661BS.3 28.48,12.24 29.8,13.56 30.68,13.56 31.48,12.76 31.48,11.78 35.86,7.4 LED4.K
  Bottom 0.508: R19.2 47.09,10.02 46.54,9.46 38.36,9.46 36.27,9.46 33.97,11.76 33.97,12.73 33.22,13.48 29.72,13.48 28.48,12.24 3661BS.3
N$32
  Bottom 0.508: 48.89,8.61 46.8,8.61 36.02,8.61 32.78,11.84 3661BS.5 | 48.89,8.61 48.89,8.64 49.77,8.64 50.42,9.3 R18.2 | 48.89,8.61 48.89,7.64 LED3.K
N$33
  Bottom 0.508: R17.2 27.7,20.44 3661BS.12
N$34
  Bottom 0.508: R16.2 40.02,11.69 40.02,14.3 39.09,15.23 26.33,15.23 23.33,12.24 3661BS.1
N$35
  Bottom 0.508: R15.2 42.83,10.2 38.21,10.2 36.67,11.75 36.67,12.58 34.81,14.44 28.14,14.44 25.94,12.24 3661BS.2
N$36
  Bottom 0.508: LED2.K 54.69,13.59 53.84,12.74 R14.2 53.84,10.68 49.29,6.12 39.69,6.12 39.69,7.16 38.98,7.87 35.46,7.87 31.09,12.24 3661BS.4
N$37
  Bottom 0.508: 3661BS.9 36.67,21.05 38.34,21.05 39.71,22.42 49.69,22.42 R13.2 53.39,22.58 LED1.K
N$38
  Bottom 0.508: R12.2 24.39,22.4 3661BS.13
N$39
  Top 0.508: Q6.3 38.17,9.79 37.86,10.1 3661BS.7
N$40
  Top 0.508: Q5.3 44.81,9.79 43.58,8.56 38.21,8.56 36.99,9.78 36.99,10.57 3661BS.6
N$41
  Top 0.508: Q4.3 44.53,24.53 43.96,25.1 39.21,25.1 37.86,23.75 3661BS.8
N$42
  Top 0.508: Q3.3 46.49,23.9 44.53,25.86 36.95,25.86 33.49,22.4 3661BS.10
N$43
  Top 0.508: Q2.3 50.48,23.9 47.78,26.59 36.65,26.59 33.65,23.59 32.29,23.59 31.09,22.4 3661BS.11
N$44
  Top 0.508: 3661BS.14 22.62,21.9 23.32,21.21 38.75,21.21 39.05,21.51 39.05,23.9 Q1.3
N$45
  Top 0.508: R10.2 50.85,12.09 Q15.1
N$46
  Top 0.508: Q15.3 50.73,9.06 52.86,9.06 | LED4.A LED3.A 52.86,9.06 | 52.86,9.06 53.02,9.06 LED2.A LED1.A
USART1_RX
  Bottom 0.254: U1.32 13.54,11.09 11.42,8.97 11.1,8.97
  Bottom 0.305: 11.1,8.97 7.85,5.72 P2.PAD_PD4
USART1_TX  (via drill 0.35)
  Top 0.305: P2.PAD_PU4 12.04,9.12 v16.29,9.12
  Bottom 0.254: U1.29 15.05,12.18 15.05,11.07 16.28,9.85 16.28,9.13 v16.29,9.12
USART2_RX
  Bottom 0.254: 19.37,18.27 19,17.9 U1.14
  Bottom 0.305: P2.PAD_PD2 19.38,26.95 19.38,20.1 19.39,20.1 19.39,18.29 19.37,18.27
USART2_TX  (via drill 0.35)
  Top 0.305: P2.PAD_PU2 22.15,29.62 20.88,28.35 v19.68,28.35
  Bottom 0.254: 18.85,19.07 18.19,18.4 U1.13
  Bottom 0.305: v19.68,28.35 19.68,28.04 18.85,27.2 18.85,19.18 18.85,19.07
USART3_RX
  Bottom 0.254: U1.23 19,13.4 22.15,10.25
  Bottom 0.305: P2.PAD_PD3 22.15,10.25
USART3_TX  (via drill 0.35)
  Top 0.305: v22.91,7.67 22.91,5.69 P2.PAD_PU3
  Bottom 0.254: U1.22 19.29,13.9 20,13.19
  Bottom 0.305: 20,13.19 22.91,10.28 v22.91,7.67
USART5_RX
  Bottom 0.254: U1.40 9.64,14.4
  Bottom 0.305: P2.PAD_PD5 1.17,16.84 7.2,16.84 9.64,14.4
USART5_TX  (via drill 0.35)
  Top 0.305: v3.41,17.72 3.01,17.32 P2.PAD_PU5
  Bottom 0.254: U1.41 9.88,14.9 9.58,15.2 9.6,15.2
  Bottom 0.305: v3.41,17.72 3.7,17.42 7.38,17.42 9.6,15.2
USART6_RX
  Bottom 0.254: U1.48 9.15,18.4 6.27,21.29
  Bottom 0.305: P2.PAD_PD1 6.27,28.13 6.27,21.29
USART6_TX  (via drill 0.35)
  Top 0.305: P2.PAD_PU1 7.85,28 v5.51,25.65
  Bottom 0.254: U1.47 8.8,17.9 5.42,21.29
  Bottom 0.305: v5.51,25.65 5.42,25.56 5.42,21.29
VDD  (via drill 0.35)
  Top 0.305: 49.13,22.8 51.51,22.8 51.52,22.81 53.02,22.81 | Q3.2 49.13,22.8 | 49.05,10.89 44.37,10.89 Q5.2 | Q4.2 45.48,22.8 | 45.48,22.8 49.13,22.8 | Q6.2 40.01,10.89 44.38,10.89 44.37,10.9 | Q1.2 41.98,22.8 45.48,22.8 | Q2.2 53.02,22.81 | 53.02,22.81 53.03,22.8 53.91,22.8 53.91,10.89 49.05,10.89 | Q15.2 49.05,10.89
  Bottom 0.254: U1.31 14.04,9.98 13.54,9.49 C5.1
  Bottom 0.508: 13.26,9.2 13.54,9.49 | v13.26,5.5 v13.25,5.49
  Bottom 0.61: 13.26,9.2 C7.1 v13.26,5.5
  pour Top (isolate 0.254, no thermals): 0.08,25.97 0,8.75 15,0.02 29.92,8.59 45,0.02 60.01,8.59 60.01,25.89 45.08,34.62 30.08,26.05 15.08,34.62 0.08,26.05
VDDA  (via drill 0.35)
  Top 0.61: FB1.1 9.36,21.13 v8.25,22.24
  Bottom 0.406: FB1.1 9.94,20.12 13.08,20.12 13.54,19.66 U1.5
  Bottom 0.508: C1.1 9.76,23.37 | 9.76,26.77 9.84,26.84
  Bottom 0.61: FB1.1 9.86,21.21 C1.1 9.28,23.27 v8.25,22.24 | 9.76,23.37 C4.1 9.76,26.77 | 9.84,26.84 13.41,26.84 13.89,26.37 C2.1
  pour Bottom (no thermals): 13.02,19.46 13.02,18.75 14.05,18.75 14.05,19.46
VSSA
  Bottom 0.254: 11.8,20.97 C3.2 | U1.7 14.52,19.12 14.52,19.66 13.21,20.97
  Bottom 0.406: 13.21,20.97 11.8,20.97
  Bottom 0.508: 11.66,23.37 C1.2 | C2.2 13.91,23.77
  Bottom 0.61: C4.2 11.66,23.75 | 11.66,23.75 11.66,23.37 | C1.2 11.56,21.21 C3.2 | C2.2 11.66,23.75 | 13.91,23.77 R2.1

### Text on the board
tPlace: 3V3 | 3V3 | R | *P2 | 3V3 | P1 | 3V3 | 3V3 | P5 | B | 3V3 | C | 3661BS | D | 3V3 | 3V3 | P4 | P3 | 3V3 | 3V3
bPlace: H3BR61
bNames: GND | GND | *P2 | R | GND | P1 | GND | GND | * | P5 | * | B | GND | C | D | GND | GND | P4 | P3 | GND | GND